# Altium schematic sheet Fader LEDs.SchDoc
size A
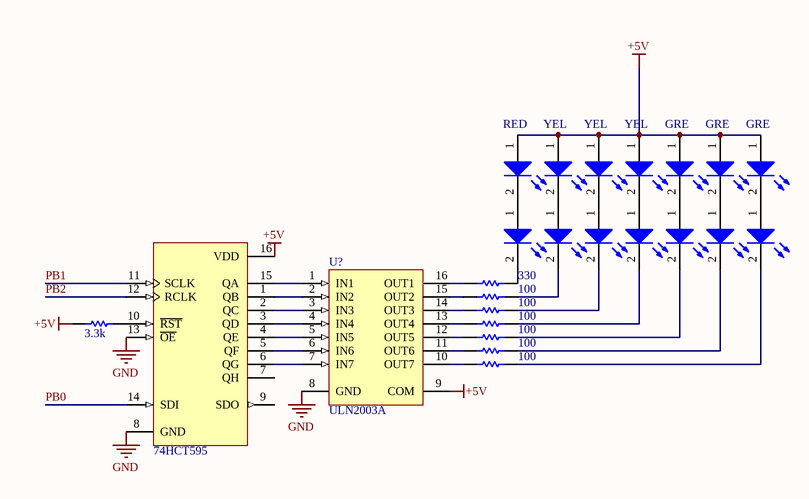
[diagram p0: Fader LEDs.SchDoc]

## Parts
(Parts that share a designator on the sheet are numbered #1, #2 ... from top to bottom, then left to right.)
DS?#1  RED  [LED-0]
DS?#2  YEL  [LED-0]
DS?#3  YEL  [LED-0]
DS?#4  YEL  [LED-0]
DS?#5  GRE  [LED-0]
DS?#6  GRE  [LED-0]
DS?#7  GRE  [LED-0]
DS?#8  LED0  [LED-0]  (value not drawn)
DS?#9  LED0  [LED-0]  (value not drawn)
DS?#10  LED0  [LED-0]  (value not drawn)
DS?#11  LED0  [LED-0]  (value not drawn)
DS?#12  LED0  [LED-0]  (value not drawn)
DS?#13  LED0  [LED-0]  (value not drawn)
DS?#14  LED0  [LED-0]  (value not drawn)
R?#1  330  [AXIAL-0.3]
R?#2  100  [AXIAL-0.3]
R?#3  100  [AXIAL-0.3]
R?#4  3.3k  [AXIAL-0.3]
R?#5  100  [AXIAL-0.3]
R?#6  100  [AXIAL-0.3]
R?#7  100  [AXIAL-0.3]
R?#8  100  [AXIAL-0.3]
U?#1  74HCT595  [DIP-16/X1.5]
U?#2  ULN2003A  [DIP-16/X1.5]

## Nets
+5V: DS?#1.1(A) DS?#2.1(A) DS?#3.1(A) DS?#4.1(A) DS?#5.1(A) DS?#6.1(A) DS?#7.1(A) R?#4.1 U?#1.16(VDD) U?#2.9(COM)
GND: U?#1.8(GND) U?#1.13(~{OE}) U?#2.8(GND)
PB0: U?#1.14(SDI)
PB1: U?#1.11(SCLK)
PB2: U?#1.12(RCLK)
NetDS?#1_2: DS?#1.2(K) DS?#8.1(A)
NetDS?#2_2: DS?#2.2(K) DS?#9.1(A)
NetDS?#3_2: DS?#3.2(K) DS?#10.1(A)
NetDS?#4_2: DS?#4.2(K) DS?#11.1(A)
NetDS?#5_2: DS?#5.2(K) DS?#12.1(A)
NetDS?#6_2: DS?#6.2(K) DS?#13.1(A)
NetDS?#7_2: DS?#7.2(K) DS?#14.1(A)
NetDS?#8_2: DS?#8.2(K) R?#1.2
NetDS?#9_2: DS?#9.2(K) R?#2.2
NetDS?#10_2: DS?#10.2(K) R?#3.2
NetDS?#11_2: DS?#11.2(K) R?#5.2
NetDS?#12_2: DS?#12.2(K) R?#6.2
NetDS?#13_2: DS?#13.2(K) R?#7.2
NetDS?#14_2: DS?#14.2(K) R?#8.2
NetR?#1_1: R?#1.1 U?#2.16(OUT1)
NetR?#2_1: R?#2.1 U?#2.15(OUT2)
NetR?#3_1: R?#3.1 U?#2.14(OUT3)
NetR?#4_2: R?#4.2 U?#1.10(~{RST})
NetR?#5_1: R?#5.1 U?#2.13(OUT4)
NetR?#6_1: R?#6.1 U?#2.12(OUT5)
NetR?#7_1: R?#7.1 U?#2.11(OUT6)
NetR?#8_1: R?#8.1 U?#2.10(OUT7)
NetU?#1_1: U?#1.1(QB) U?#2.2(IN2)
NetU?#1_2: U?#1.2(QC) U?#2.3(IN3)
NetU?#1_3: U?#1.3(QD) U?#2.4(IN4)
NetU?#1_4: U?#1.4(QE) U?#2.5(IN5)
NetU?#1_5: U?#1.5(QF) U?#2.6(IN6)
NetU?#1_6: U?#1.6(QG) U?#2.7(IN7)
NetU?#1_15: U?#1.15(QA) U?#2.1(IN1)

Not connected (* = marked no-connect by the designer): U?#1 7(QH) 9(SDO)

## Library data of the parts
DS?#1-DS?#14 = LED0: Typical INFRARED GaAs LED; Manufacturer: Generic Components; Class: Optoelectronic; Published: 08/06/2000; Publisher: Altium Hobart Technology Centre; SubClass: LED
R?#1-R?#3 R?#5-R?#8 = Res1: Resistor; Manufacturer: Generic Components; Class: Passive; Value: 15; Published: 08/06/2000; Publisher: Altium Hobart Technology Centre; SubClass: Resistor
R?#4 = Res1: Resistor; Manufacturer: Generic Components; Class: Passive; Published: 08/06/2000; Publisher: Altium Hobart Technology Centre; SubClass: Resistor
U?#1 = 74xxx595: 8-Bit Serial-Input/Serial or Prallel-Output Shift Register with Latched 3-State Outputs; Manufacturer: ON Semiconductor; Class: Logic; Published: 15/04/2002; Publisher: Altium Hobart Technology Centre; SubClass: Register
U?#2 = ULN2003A: High-Voltage, High-Current Darlington Array; Manufacturer: Allegro; Class: Interface; SubClass: Darlington Driver; Published: 13/10/2000; Publisher: Altium Hobart Technology Centre